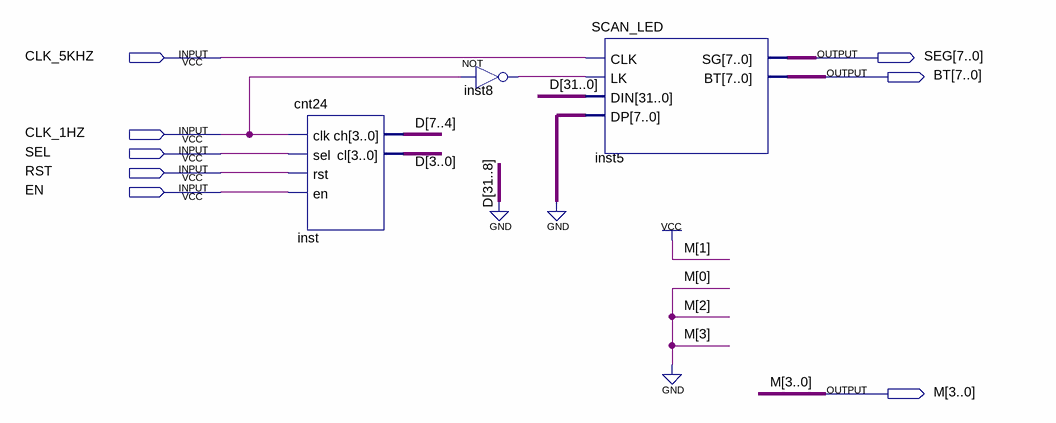
[diagram p0: schematic sheet]
// Quartus schematic SEG7_dis.bdf as structural Verilog: 3 symbols, 8 pins
module SEG7_dis (
  input  CLK_5KHZ,
  input  CLK_1HZ,
  input  SEL,
  input  RST,
  input  EN,
  output [7:0] SEG,
  output [7:0] BT,
  output [3:0] M
);

  wire inst8_out;
  wire [7:0] D;

  cnt24 inst (.clk(CLK_1HZ), .sel(SEL), .rst(RST), .en(EN), .ch(D[7:4]), .cl(D[3:0]));
  not inst8 (inst8_out, CLK_1HZ);
  SCAN_LED inst5 (.CLK(CLK_5KHZ), .LK(inst8_out), .DIN({{24{1'b0}}, D}), .DP({8{1'b0}}), .SG(SEG), .BT(BT));

  assign M = 4'b0010;
endmodule
